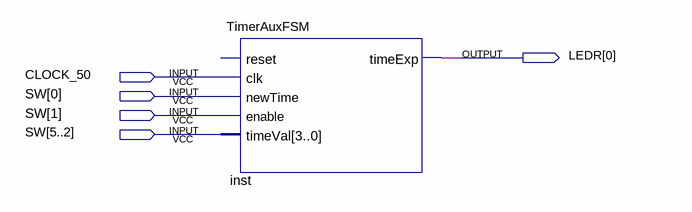
[diagram p0: schematic sheet]
// Quartus schematic TimerAuxFSM_B.bdf as structural Verilog: 1 symbols, 5 pins
module TimerAuxFSM_B (
  input  CLOCK_50,
  input  [5:0] SW,
  output [0:0] LEDR
);

  TimerAuxFSM inst (
    .clk(CLOCK_50), .newTime(SW[0]), .enable(SW[1]), .timeVal(SW[5:2]), .timeExp(LEDR[0]));  // open: reset
endmodule
